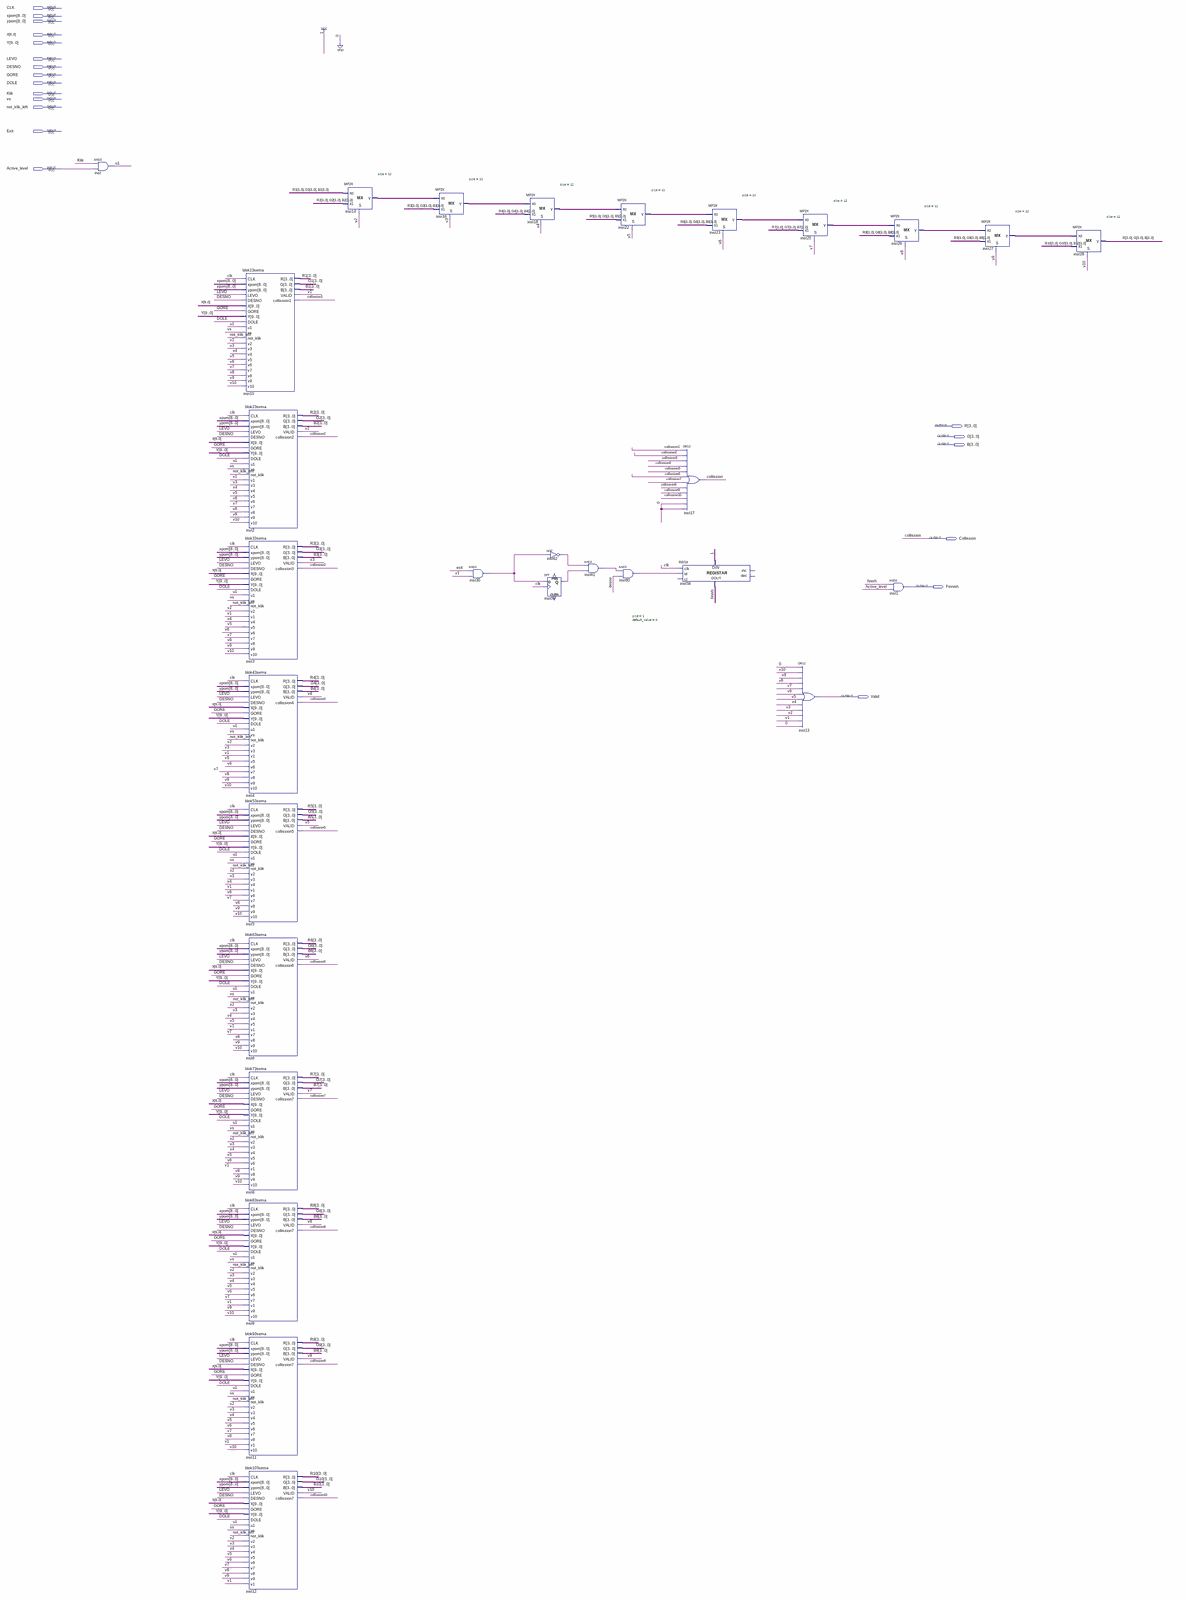
[diagram p0: schematic sheet, whole]
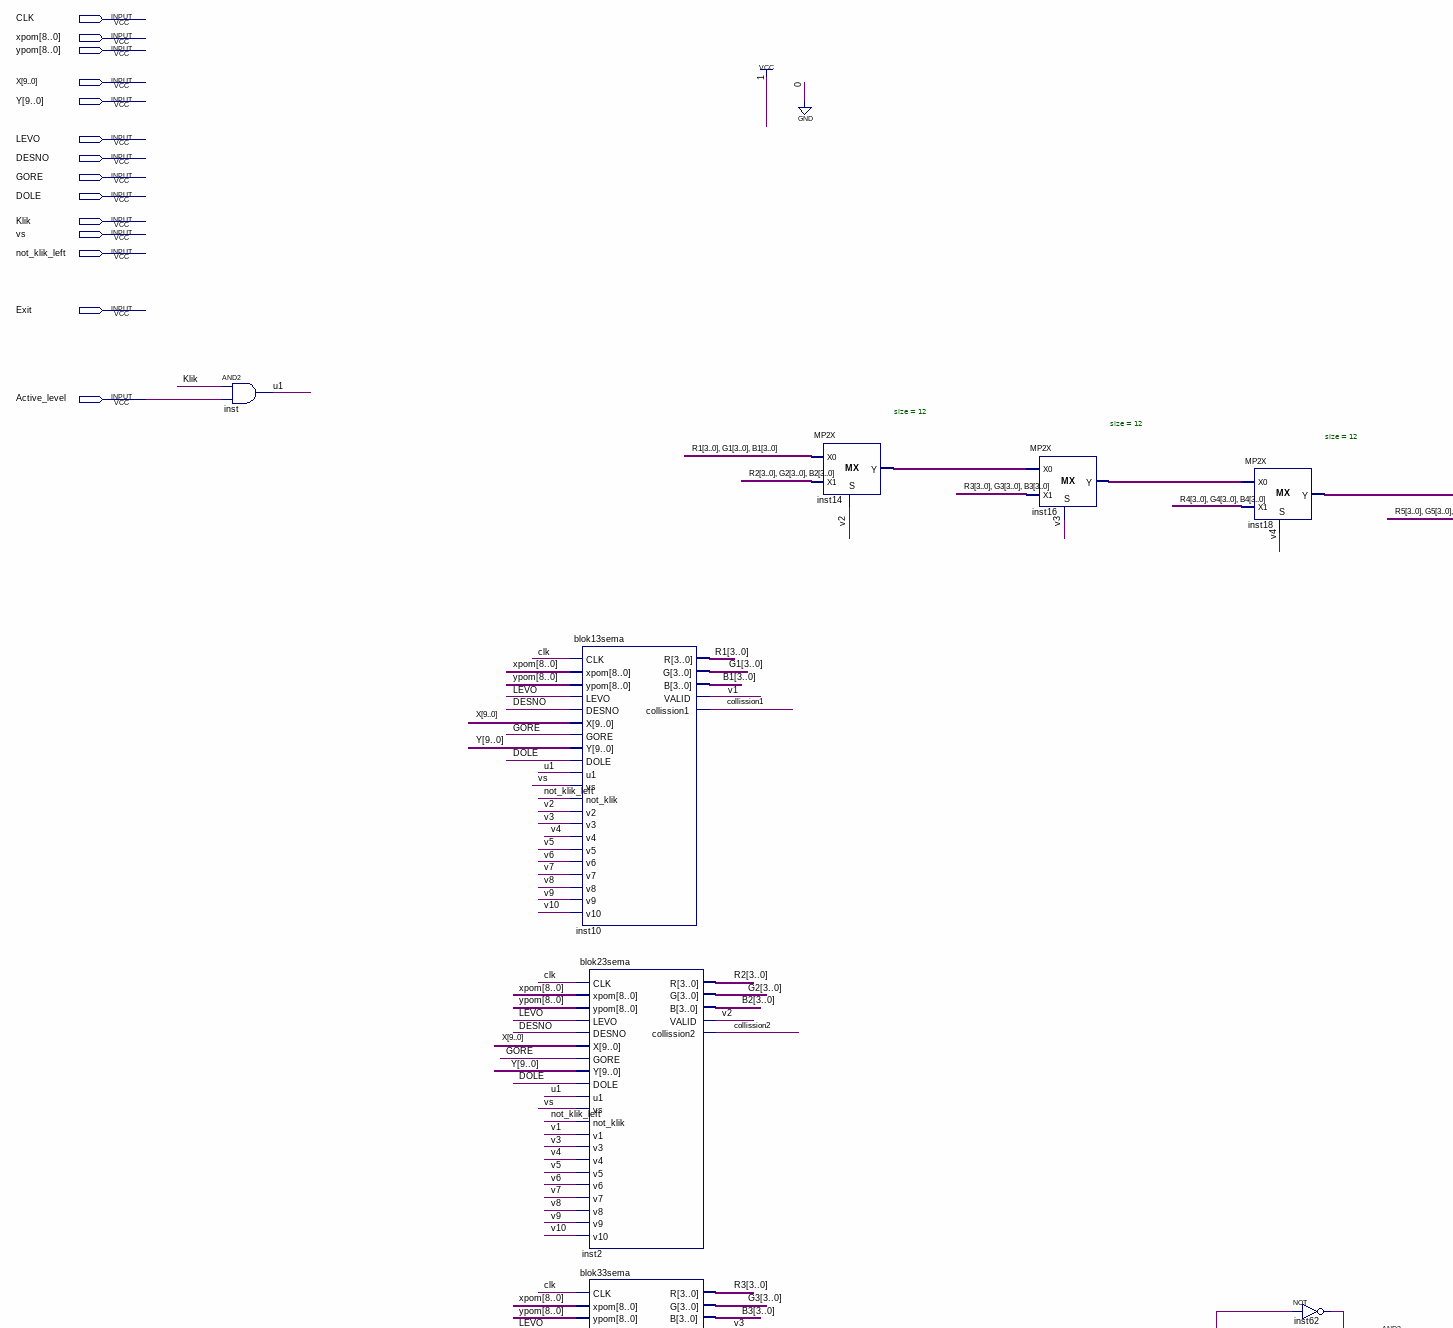
[diagram p1: schematic sheet, upper left part]
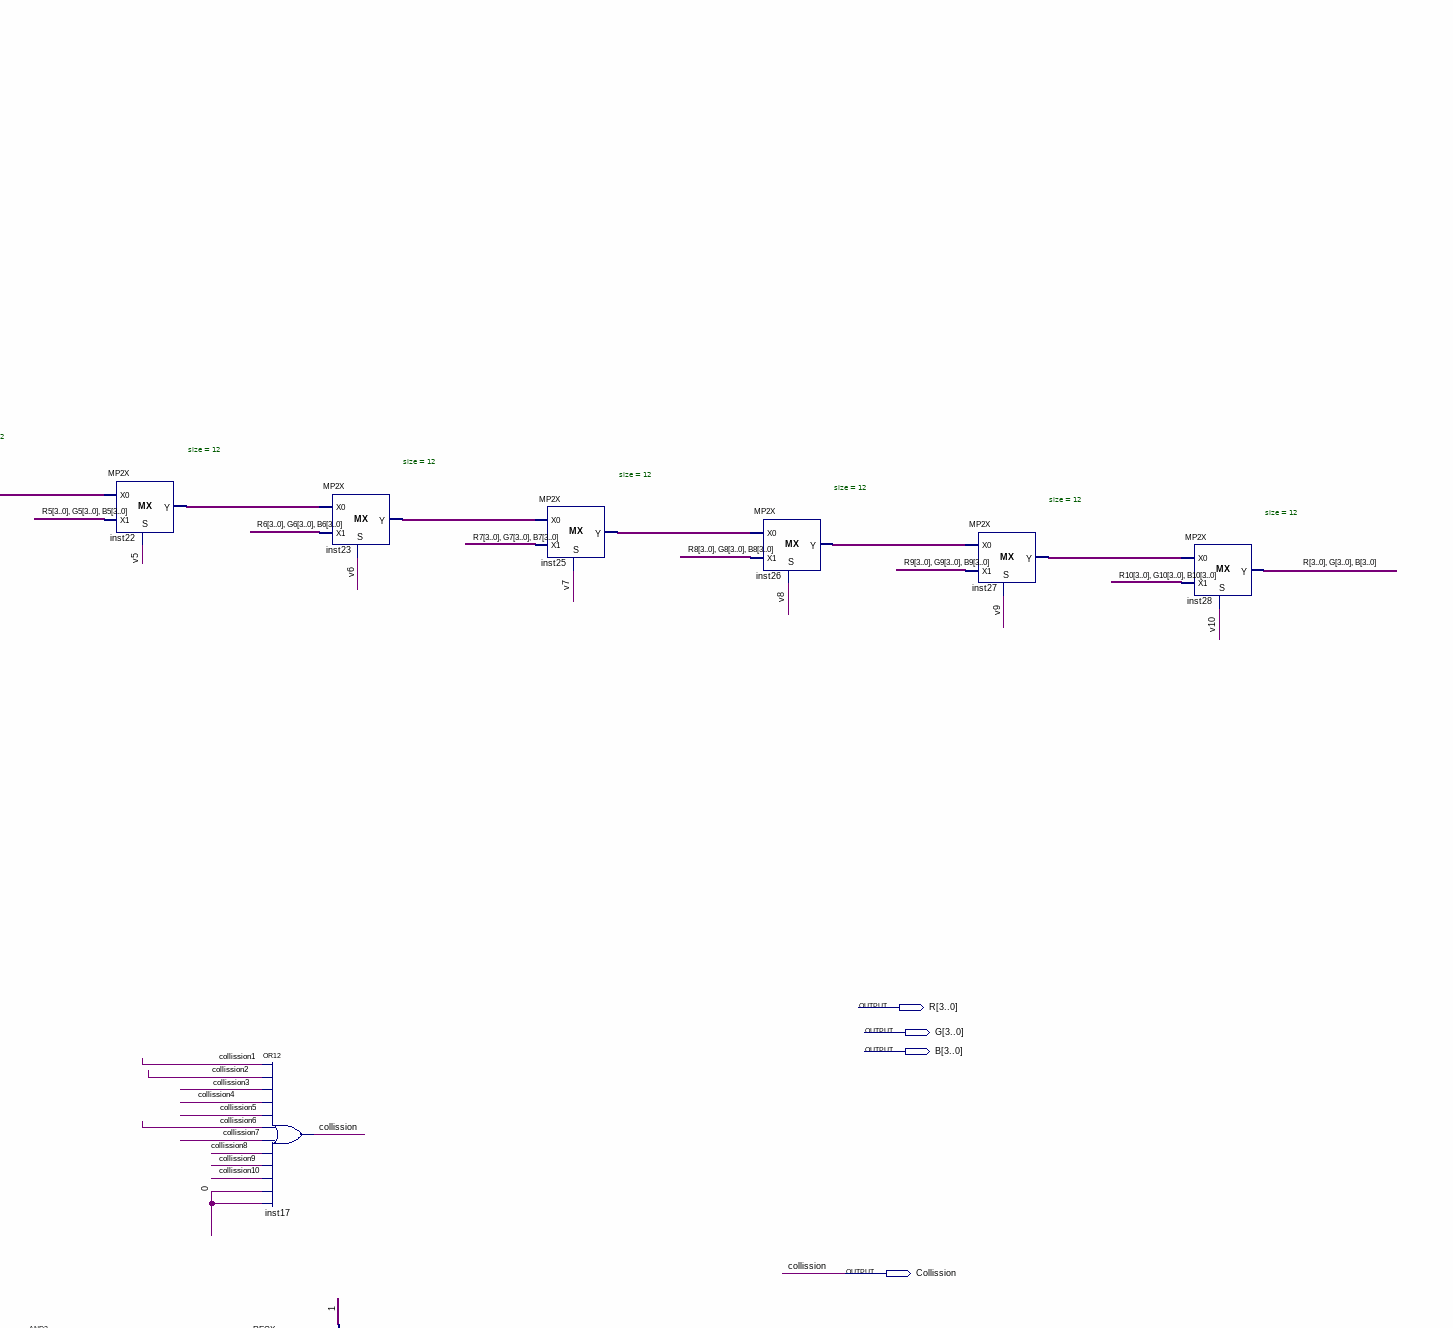
[diagram p2: schematic sheet, upper right part]
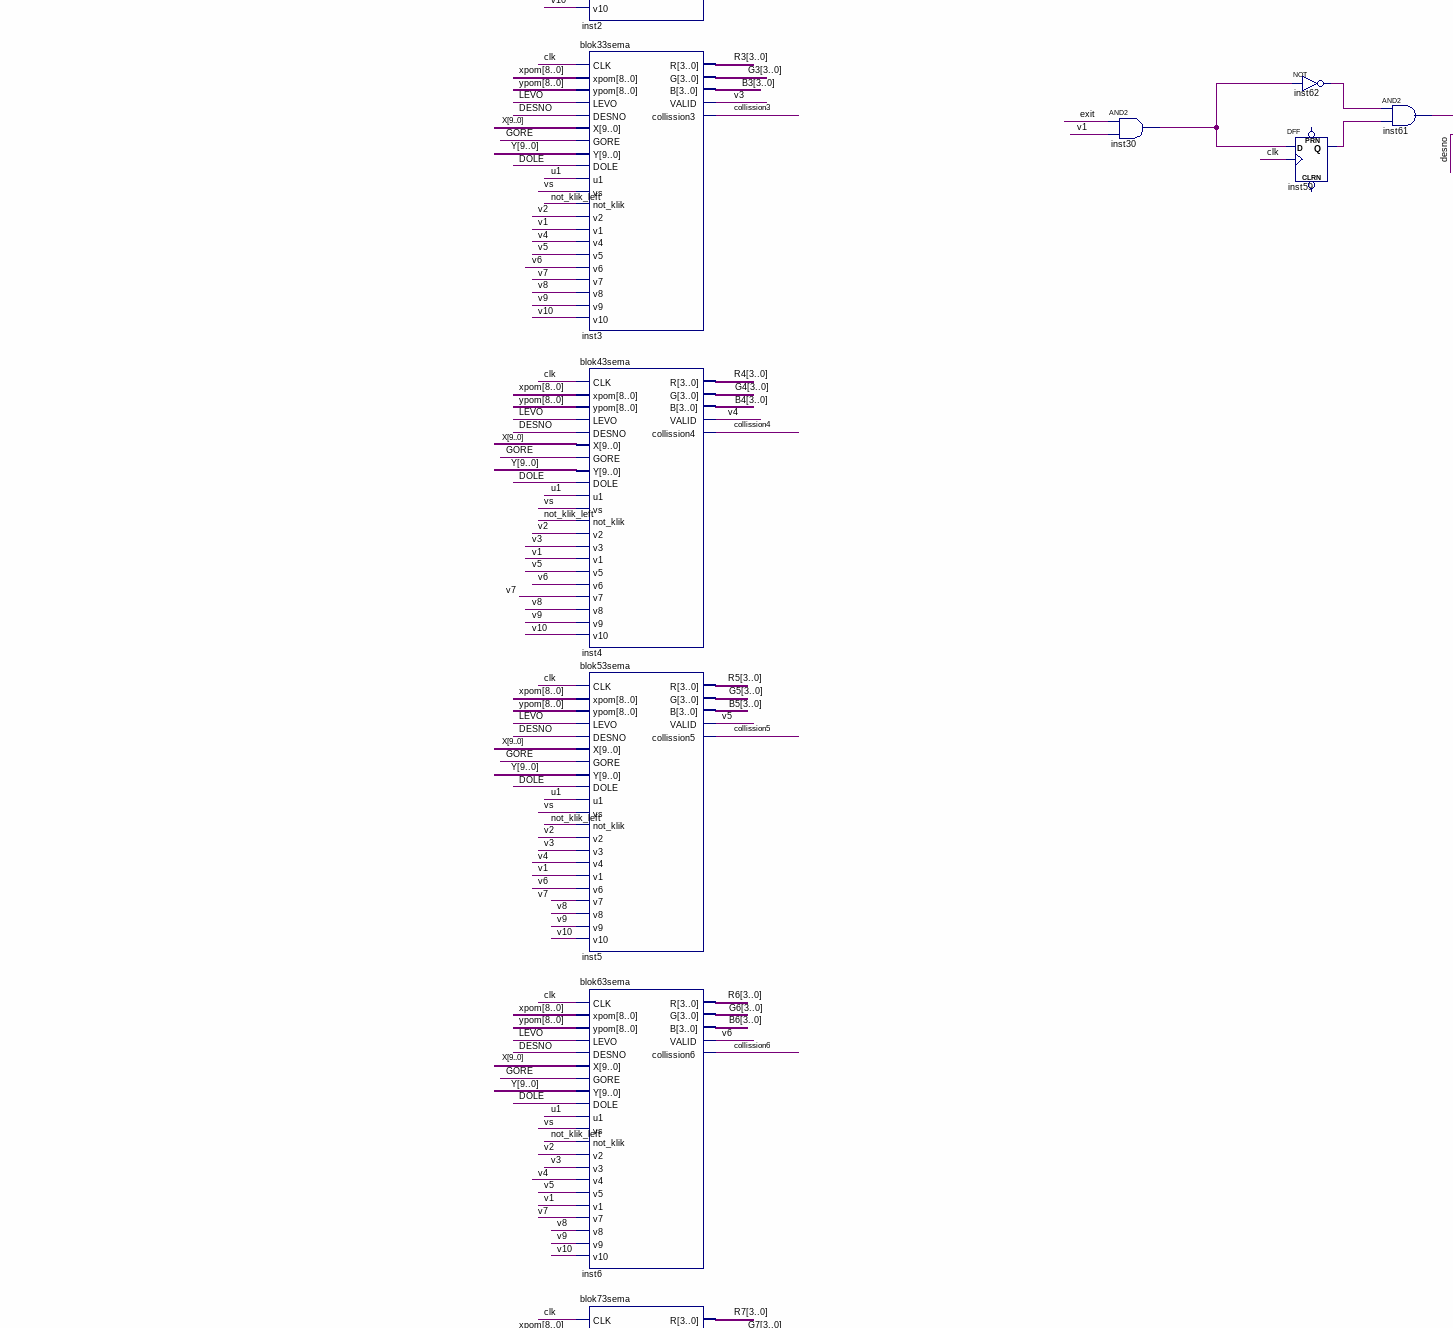
[diagram p3: schematic sheet, middle left part]
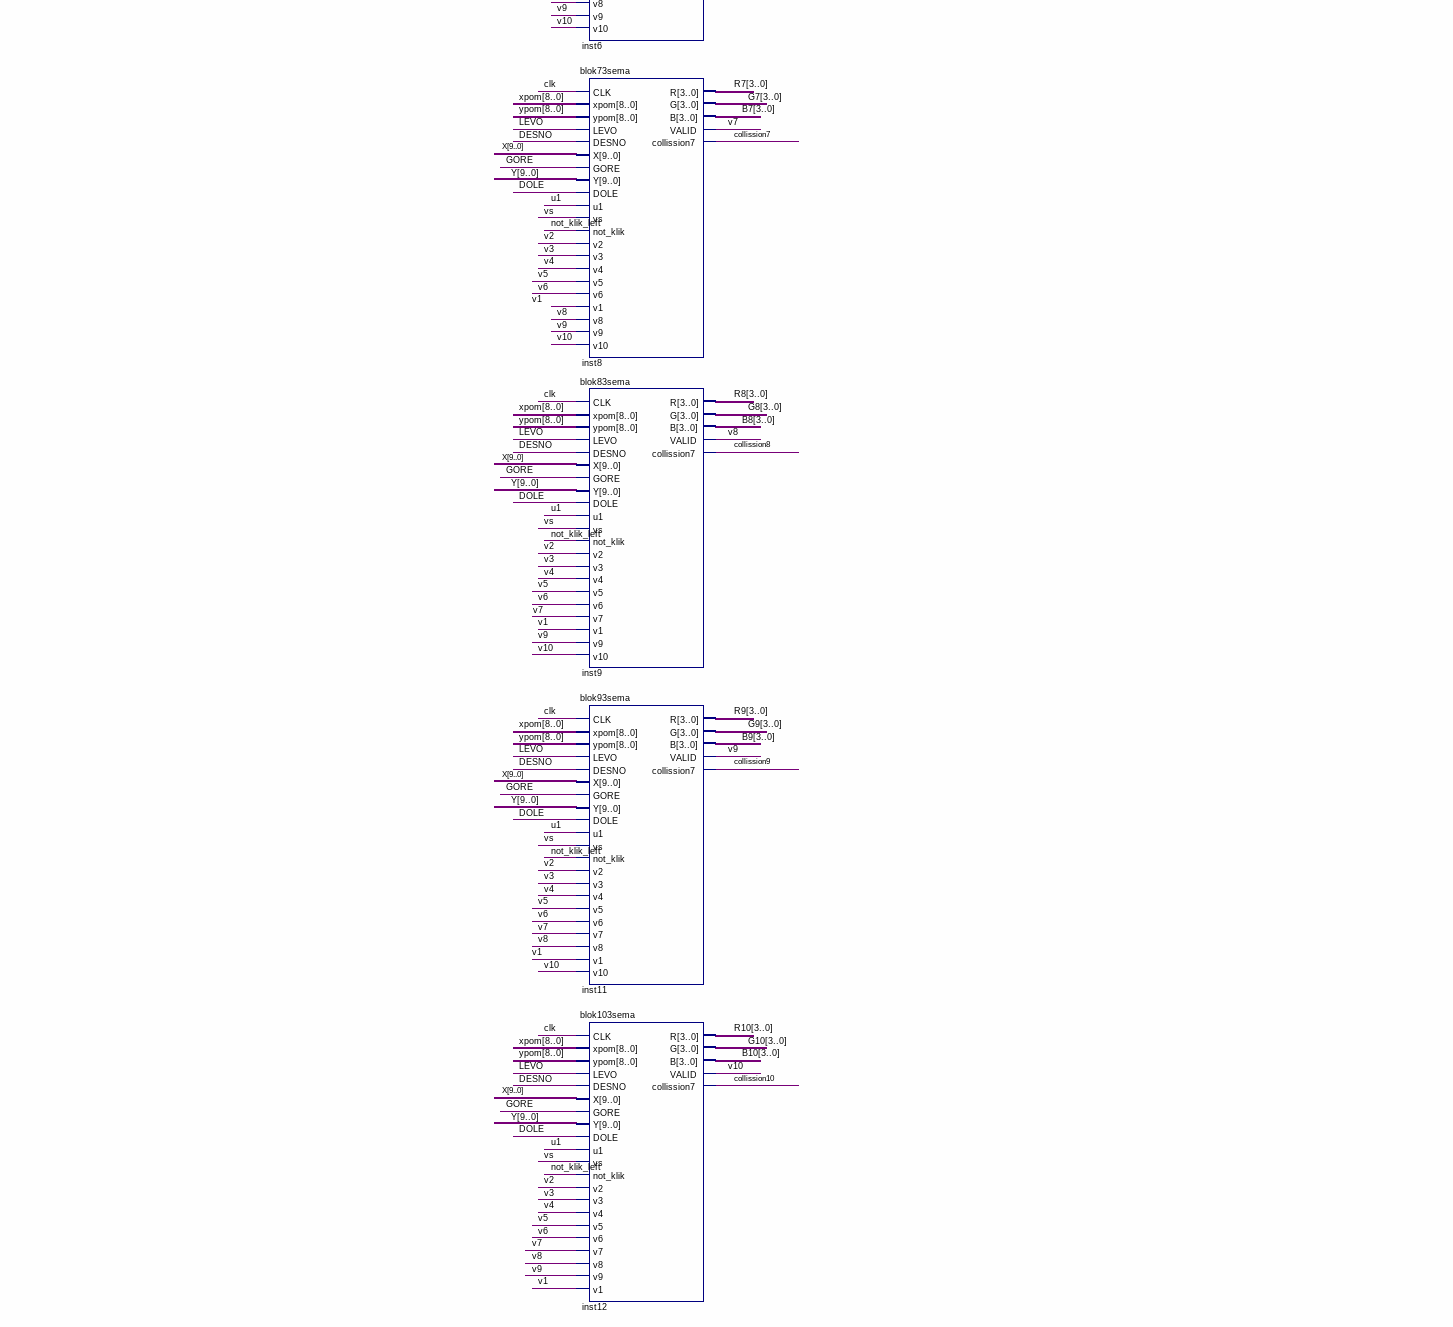
[diagram p4: schematic sheet, lower left part]
// Quartus schematic Level3.bdf as structural Verilog: 29 symbols, 20 pins
module Level3 (
  input  CLK,
  input  [8:0] xpom,
  input  [8:0] ypom,
  input  [9:0] X,
  input  [9:0] Y,
  input  LEVO,
  input  DESNO,
  input  GORE,
  input  DOLE,
  input  Klik,
  input  vs,
  input  not_klik_left,
  input  Exit,
  input  Active_level,
  output [3:0] R,
  output [3:0] G,
  output [3:0] B,
  output Collission,
  output Finnish,
  output Valid
);

  wire collission1, collission2, collission3, collission4, collission5, collission6, collission7,
       collission8, collission9, collission10, finish, inst30_out, inst59_q, inst60_out, inst61_out,
       inst62_out, u1, v1, v2, v3, v4, v5, v6, v7, v8, v9, v10;
  wire [3:0] B1, B2, B3, B4, B5, B6, B7, B8, B9, B10, G1, G2, G3, G4, G5, G6, G7, G8, G9, G10, R1, R2, R3,
       R4, R5, R6, R7, R8, R9, R10;
  wire [11:0] inst14_y, inst16_y, inst18_y, inst22_y, inst23_y, inst25_y, inst26_y, inst27_y;

  and inst (u1, Klik, Active_level);
  blok13sema inst10 (
    .CLK(CLK), .xpom(xpom), .ypom(ypom), .LEVO(LEVO), .DESNO(DESNO), .X(X), .GORE(GORE), .Y(Y), .DOLE(DOLE),
    .u1(u1), .vs(vs), .not_klik(not_klik_left), .v2(v2), .v3(v3), .v4(v4), .v5(v5), .v6(v6), .v7(v7),
    .v8(v8), .v9(v9), .v10(v10), .R(R1), .G(G1), .B(B1), .VALID(v1), .collission1(collission1));
  blok23sema inst2 (
    .CLK(CLK), .xpom(xpom), .ypom(ypom), .LEVO(LEVO), .DESNO(DESNO), .X(X), .GORE(GORE), .Y(Y), .DOLE(DOLE),
    .u1(u1), .vs(vs), .not_klik(not_klik_left), .v1(v1), .v3(v3), .v4(v4), .v5(v5), .v6(v6), .v7(v7),
    .v8(v8), .v9(v9), .v10(v10), .R(R2), .G(G2), .B(B2), .VALID(v2), .collission2(collission2));
  blok33sema inst3 (
    .CLK(CLK), .xpom(xpom), .ypom(ypom), .LEVO(LEVO), .DESNO(DESNO), .X(X), .GORE(GORE), .Y(Y), .DOLE(DOLE),
    .u1(u1), .vs(vs), .not_klik(not_klik_left), .v2(v2), .v1(v1), .v4(v4), .v5(v5), .v6(v6), .v7(v7),
    .v8(v8), .v9(v9), .v10(v10), .R(R3), .G(G3), .B(B3), .VALID(v3), .collission3(collission3));
  blok43sema inst4 (
    .CLK(CLK), .xpom(xpom), .ypom(ypom), .LEVO(LEVO), .DESNO(DESNO), .X(X), .GORE(GORE), .Y(Y), .DOLE(DOLE),
    .u1(u1), .vs(vs), .not_klik(not_klik_left), .v2(v2), .v3(v3), .v1(v1), .v5(v5), .v6(v6), .v7(v7),
    .v8(v8), .v9(v9), .v10(v10), .R(R4), .G(G4), .B(B4), .VALID(v4), .collission4(collission4));
  blok53sema inst5 (
    .CLK(CLK), .xpom(xpom), .ypom(ypom), .LEVO(LEVO), .DESNO(DESNO), .X(X), .GORE(GORE), .Y(Y), .DOLE(DOLE),
    .u1(u1), .vs(vs), .not_klik(not_klik_left), .v2(v2), .v3(v3), .v4(v4), .v1(v1), .v6(v6), .v7(v7),
    .v8(v8), .v9(v9), .v10(v10), .R(R5), .G(G5), .B(B5), .VALID(v5), .collission5(collission5));
  blok63sema inst6 (
    .CLK(CLK), .xpom(xpom), .ypom(ypom), .LEVO(LEVO), .DESNO(DESNO), .X(X), .GORE(GORE), .Y(Y), .DOLE(DOLE),
    .u1(u1), .vs(vs), .not_klik(not_klik_left), .v2(v2), .v3(v3), .v4(v4), .v5(v5), .v1(v1), .v7(v7),
    .v8(v8), .v9(v9), .v10(v10), .R(R6), .G(G6), .B(B6), .VALID(v6), .collission6(collission6));
  blok73sema inst8 (
    .CLK(CLK), .xpom(xpom), .ypom(ypom), .LEVO(LEVO), .DESNO(DESNO), .X(X), .GORE(GORE), .Y(Y), .DOLE(DOLE),
    .u1(u1), .vs(vs), .not_klik(not_klik_left), .v2(v2), .v3(v3), .v4(v4), .v5(v5), .v6(v6), .v1(v1),
    .v8(v8), .v9(v9), .v10(v10), .R(R7), .G(G7), .B(B7), .VALID(v7), .collission7(collission7));
  blok83sema inst9 (
    .CLK(CLK), .xpom(xpom), .ypom(ypom), .LEVO(LEVO), .DESNO(DESNO), .X(X), .GORE(GORE), .Y(Y), .DOLE(DOLE),
    .u1(u1), .vs(vs), .not_klik(not_klik_left), .v2(v2), .v3(v3), .v4(v4), .v5(v5), .v6(v6), .v7(v7),
    .v1(v1), .v9(v9), .v10(v10), .R(R8), .G(G8), .B(B8), .VALID(v8), .collission7(collission8));
  blok93sema inst11 (
    .CLK(CLK), .xpom(xpom), .ypom(ypom), .LEVO(LEVO), .DESNO(DESNO), .X(X), .GORE(GORE), .Y(Y), .DOLE(DOLE),
    .u1(u1), .vs(vs), .not_klik(not_klik_left), .v2(v2), .v3(v3), .v4(v4), .v5(v5), .v6(v6), .v7(v7),
    .v8(v8), .v1(v1), .v10(v10), .R(R9), .G(G9), .B(B9), .VALID(v9), .collission7(collission9));
  blok103sema inst12 (
    .CLK(CLK), .xpom(xpom), .ypom(ypom), .LEVO(LEVO), .DESNO(DESNO), .X(X), .GORE(GORE), .Y(Y), .DOLE(DOLE),
    .u1(u1), .vs(vs), .not_klik(not_klik_left), .v2(v2), .v3(v3), .v4(v4), .v5(v5), .v6(v6), .v7(v7),
    .v8(v8), .v9(v9), .v1(v1), .R(R10), .G(G10), .B(B10), .VALID(v10), .collission7(collission10));
  MP2X #(.size(12)) inst14 (.S(v2), .X0({R1, G1, B1}), .X1({R2, G2, B2}), .Y(inst14_y));
  MP2X #(.size(12)) inst16 (.S(v3), .X0(inst14_y), .X1({R3, G3, B3}), .Y(inst16_y));
  and inst30 (inst30_out, Exit, v1);
  MP2X #(.size(12)) inst18 (.S(v4), .X0(inst16_y), .X1({R4, G4, B4}), .Y(inst18_y));
  DFF inst59 (.CLK(CLK), .D(inst30_out), .Q(inst59_q));  // open: CLRN, PRN
  not inst62 (inst62_out, inst30_out);
  and inst61 (inst61_out, inst62_out, inst59_q);
  MP2X #(.size(12)) inst22 (.S(v5), .X0(inst18_y), .X1({R5, G5, B5}), .Y(inst22_y));
  and inst60 (inst60_out, inst61_out, DESNO);
  or inst17 (Collission, collission1, collission2, collission3, collission4, collission5, collission6, collission7, collission8, collission9, collission10, 1'b0, 1'b0);
  REGX #(.size(1), .default_value(0)) inst58 (
    .clk(CLK), .ld(inst60_out), .data_in(1'b1), .data_out(finish));  // open: cl, inc, dec
  MP2X #(.size(12)) inst23 (.S(v6), .X0(inst22_y), .X1({R6, G6, B6}), .Y(inst23_y));
  MP2X #(.size(12)) inst25 (.S(v7), .X0(inst23_y), .X1({R7, G7, B7}), .Y(inst25_y));
  or inst13 (Valid, 1'b0, v10, v9, v8, v7, v6, v5, v4, v3, v2, v1, 1'b0);
  MP2X #(.size(12)) inst26 (.S(v8), .X0(inst25_y), .X1({R8, G8, B8}), .Y(inst26_y));
  and inst1 (Finnish, finish, Active_level);
  MP2X #(.size(12)) inst27 (.S(v9), .X0(inst26_y), .X1({R9, G9, B9}), .Y(inst27_y));
  MP2X #(.size(12)) inst28 (.S(v10), .X0(inst27_y), .X1({R10, G10, B10}), .Y({R, G, B}));
endmodule
